# Altium schematic sheet bridge_connection.SchDoc
size A3; SheetNumber: 4; SheetTotal: 4
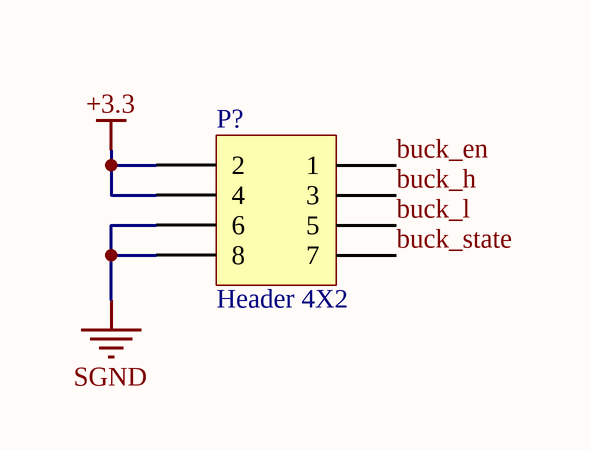
[diagram p0: bridge_connection.SchDoc]

## Parts
P?  Header 4X2  [HEADER_4_2]

## Nets
+3.3: P?.2 P?.4
SGND: P?.6 P?.8
buck_en: P?.1
buck_h: P?.3
buck_l: P?.5
buck_state: P?.7

## Notes on the sheet
- 1
- 2
- 3
- 4
- 5
- 6
- 7
- 8
- A
- B
- C
- D
- Project:
- Date:
- Drawing number:
- Rev:
- Format:
- A3
- Drawn by:
- Laboratory:
- Page
- Sheet:
- of
- File:

## Library data of the parts
P? = Header 4X2: Header, 4-Pin, Dual row; System: Connector; LatestRevisionDate: 17-Jul-2002; LatestRevisionNote: Re-released for DXP Platform.; Publisher: Altium Limited